# Altium project SolderStation_ESP32_Hacking.PrjPcb
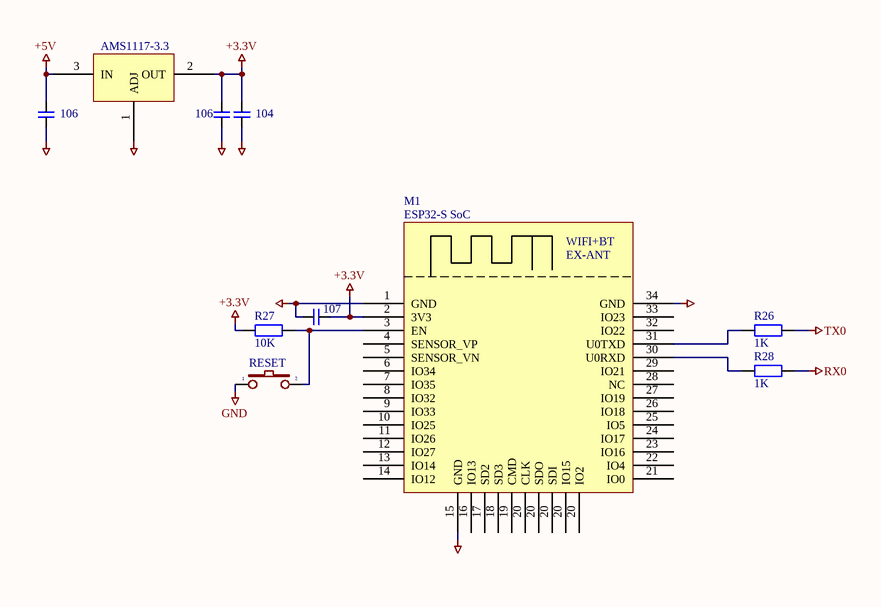
[diagram p0: [SCH]_MainProcessor.SchDoc]
4 sheets, 60 parts. Net scope: global (net labels, ports and power ports of the same name join across sheets).
Sheets:
  [SCH]_MainProcessor.SchDoc
  [SCH]_OldSensor.SchDoc
  [SCH]_OldDriver.SchDoc
  [SCH]_ThermoCouple.SchDoc

## Sheet [SCH]_MainProcessor.SchDoc
size A

### Parts
C13  106  [CAP-SMD-01005]
C14  106  [CAP-SMD-01005]
C15  104  [CAP-SMD-01005]
C16  107  [CAP-SMD-01005]
IC4  AMS1117-3.3  [SOT223(123)]
K1  RESET  [Button-SMD2/3x6]
M1  ESP32-S SoC  [ESP32-S-Footprint]
R26  1K  [RES-SMD-0805]
R27  10K  [RES-SMD-0805]
R28  1K  [RES-SMD-0805]

### Nets
+3.3V: C14.2 C15.2 C16.2 IC4.2(OUT) M1.2(3V3) R27.2
+5V: C13.2 IC4.3(IN)
GND: C13.1 C14.1 C15.1 C16.1 IC4.1(ADJ) K1.1 M1.1(GND) M1.15(GND) M1.34(GND)
RX0: R28.1
TX0: R26.1
NetK1_2: K1.2 M1.3(EN) R27.1
NetM1_30: M1.30(U0RXD) R28.2
NetM1_31: M1.31(U0TXD) R26.2

Not connected (* = marked no-connect by the designer): M1 4(SENSOR_VP) 5(SENSOR_VN) 6(IO34) 7(IO35) 8(IO32) 9(IO33) 10(IO25) 11(IO26) 12(IO27) 13(IO14) 14(IO12) 16(IO13) 17(SD2) 18(SD3) 19(CMD) 20(CLK) 21(IO0) 22(IO4) 23(IO16) 24(IO17) 25(IO5) 26(IO18) 27(IO19) 28(NC) 29(IO21) 32(IO22) 33(IO23)

### Notes on the sheet
- (in symbol ESP32-S WIFI_BT_SoC) WIFI+BT; EX-ANT

### Library data of the parts
C13-C16 = Cap-Non-SMD: Non-polar capacitor
IC4 = AMS1117
K1 = Button-2: Switch button 2 pin; Value: SW chip 2 pin
M1 = ESP32-S WIFI_BT_SoC: ComponentLink1Description: PCB; ComponentLink1URL: https://evertdekker.com/wp/?p=854
R26-R28 = Res SMD: Resistor SMD

## Sheet [SCH]_OldSensor.SchDoc
size A
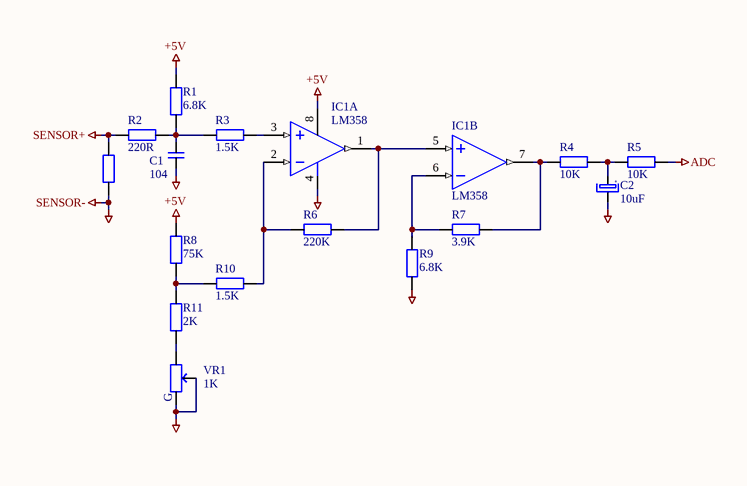
[diagram p1: [SCH]_OldSensor.SchDoc]

### Parts
C1  104  [Cap-Non-150mil]
C2  10uF  [Cap-P-1.5/4]
IC1  LM358  [DIP8]  (parts A,B of 2)
R1  6.8K  [Res1/4W]
R2  220R  [Res1/4W]
R3  1.5K  [Res1/4W]
R4  10K  [Res1/4W]
R5  10K  [Res1/4W]
R6  220K  [Res1/4W]
R7  3.9K  [Res1/4W]
R8  75K  [Res1/4W]
R9  6.8K  [Res1/4W]
R10  1.5K  [Res1/4W]
R11  2K  [Res1/4W]
SENSOR1  5R  [Res1/4W]  (value not drawn)
VR1  1K  [VR-S3]

### Nets
+5V: IC1.8(+V) R1.2 R8.2
ADC: R5.2
GND: C1.1 C2.2 IC1.4(-V) R9.1 SENSOR1.1 VR1.1 VR1.2  [also labelled SENSOR-]
SENSOR+: R2.1 SENSOR1.2
NetC1_2: C1.2 R1.1 R2.2 R3.1
NetC2_1: C2.1 R4.2 R5.1
NetIC1_1: IC1.1(OUT) IC1.5(IN+) R6.2
NetIC1_2: IC1.2(IN-) R6.1 R10.2
NetIC1_3: IC1.3(IN+) R3.2
NetIC1_6: IC1.6(IN-) R7.1 R9.2
NetIC1_7: IC1.7(OUT) R4.1 R7.2
NetR8_1: R8.1 R10.1 R11.2
NetR11_1: R11.1 VR1.3

### Notes on the sheet
- (in symbol Cap-Pol-Dip) +
- (in symbol Res-Var-Singal) G

### Library data of the parts
C1 = Cap-Non-Dip: Non-polar capacitor
C2 = Cap-Pol-Dip: Polarized capacitor
IC1 = LM358: Low-Power Dual Operational Amplifier; Value: LM358
R1-R11 SENSOR1 = Res 1/4W: Resistor 1/4W
VR1 = Res-Var-Singal: Variable Resistor

## Sheet [SCH]_OldDriver.SchDoc
size A
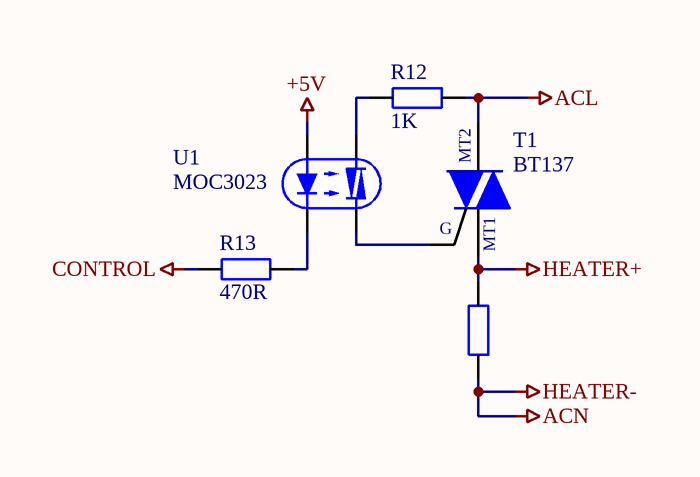
[diagram p2: [SCH]_OldDriver.SchDoc]

### Parts
R12  1K  [Res1/4W]
R13  470R  [Res1/4W]
SENSOR2  5R  [Res1/4W]  (value not drawn)
T1  BT137  [TO220H2]
U1  MOC3023  [DIL6-300b]

### Nets
+5V: U1.1(A)
ACL: R12.2 T1.2(MT2)
ACN: SENSOR2.1  [also labelled HEATER-]
CONTROL: R13.1
HEATER+: SENSOR2.2 T1.1(MT1)
NetR12_1: R12.1 U1.6(A2)
NetR13_2: R13.2 U1.2(C)
NetT1_3: T1.3(IN) U1.4(A1)

### Notes on the sheet
- (in symbol BT137) G

### Library data of the parts
R12 R13 SENSOR2 = Res 1/4W: Resistor 1/4W
T1 = BT137: Triacs - 8A; Value: LM317
U1 = MOC3023: Price: 0.82

## Sheet [SCH]_ThermoCouple.SchDoc
size A
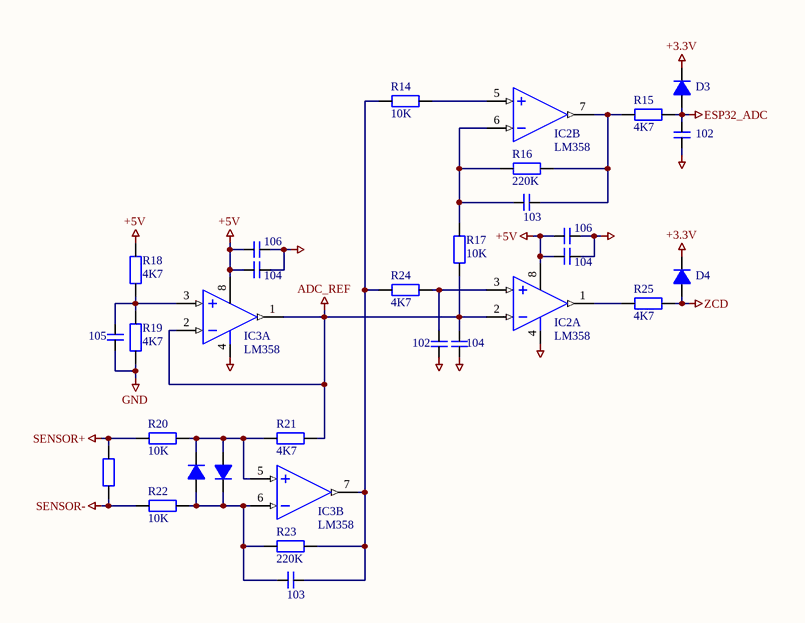
[diagram p3: [SCH]_ThermoCouple.SchDoc]

### Parts
C3  102  [CAP-SMD-01005]
C4  106  [CAP-SMD-01005]
C5  106  [CAP-SMD-01005]
C6  104  [CAP-SMD-01005]
C7  104  [CAP-SMD-01005]
C8  105  [CAP-SMD-01005]
C9  104  [CAP-SMD-01005]
C10  103  [CAP-SMD-01005]
C11  103  [CAP-SMD-01005]
C12  102  [CAP-SMD-01005]
D1  SS14  [SOD 106]  (value not drawn)
D2  SS14  [SOD 106]  (value not drawn)
D3  SS14  [SOD 106]  (value not drawn)
D4  SS14  [SOD 106]  (value not drawn)
IC2  LM358  [DIP8]  (parts A,B of 2)
IC3  LM358  [DIP8]  (parts A,B of 2)
R14  10K  [RES-SMD-0805]
R15  4K7  [RES-SMD-0805]
R16  220K  [RES-SMD-0805]
R17  10K  [RES-SMD-0805]
R18  4K7  [RES-SMD-0805]
R19  4K7  [RES-SMD-0805]
R20  10K  [RES-SMD-0805]
R21  4K7  [RES-SMD-0805]
R22  10K  [RES-SMD-0805]
R23  220K  [RES-SMD-0805]
R24  4K7  [RES-SMD-0805]
R25  4K7  [RES-SMD-0805]
SENSOR3  5R  [Res1/4W]  (value not drawn)

### Nets
+3.3V: D3.2(K) D4.2(K)
+5V: C4.1 C5.1 C6.1 C7.1 IC2.8(+V) IC3.8(+V) R18.2
ADC_REF: C9.2 IC2.2(IN-) IC3.1(OUT) IC3.2(IN-) R17.1 R21.2
ESP32_ADC: C3.2 D3.1(A) R15.1
GND: C3.1 C4.2 C5.2 C6.2 C7.2 C8.1 C9.1 C12.1 IC2.4(-V) IC3.4(-V) R19.1 R22.2 SENSOR3.1  [also labelled SENSOR-]
SENSOR+: R20.2 SENSOR3.2
ZCD: D4.1(A) R25.1
NetC8_2: C8.2 IC3.3(IN+) R18.1 R19.2
NetC10_1: C10.1 IC2.7(OUT) R15.2 R16.1
NetC10_2: C10.2 IC2.6(IN-) R16.2 R17.2
NetC11_1: C11.1 IC3.7(OUT) R14.2 R23.2 R24.2
NetC11_2: C11.2 D1.1(A) D2.2(K) IC3.6(IN-) R22.1 R23.1
NetC12_2: C12.2 IC2.3(IN+) R24.1
NetD1_2: D1.2(K) D2.1(A) IC3.5(IN+) R20.1 R21.1
NetIC2_1: IC2.1(OUT) R25.2
NetIC2_5: IC2.5(IN+) R14.1

### Library data of the parts
C3-C12 = Cap-Non-SMD: Non-polar capacitor
D1-D4 = Diode SMD
IC2 IC3 = LM358: Low-Power Dual Operational Amplifier; Value: LM358
R14-R25 = Res SMD: Resistor SMD
SENSOR3 = Res 1/4W: Resistor 1/4W

## Nets that join several sheets
+3.3V: [SCH]_MainProcessor (6 pins), [SCH]_ThermoCouple (D3.2 D4.2)
+5V: [SCH]_MainProcessor (C13.2 IC4.3), [SCH]_OldSensor (IC1.8 R1.2 R8.2), [SCH]_OldDriver (U1.1), [SCH]_ThermoCouple (7 pins)
GND: [SCH]_MainProcessor (9 pins), [SCH]_OldSensor (7 pins), [SCH]_ThermoCouple (13 pins)
SENSOR+: [SCH]_OldSensor (R2.1 SENSOR1.2), [SCH]_ThermoCouple (R20.2 SENSOR3.2)